# Altium schematic sheet 3dB_Attenuator.SchDoc
size A4; SheetNumber: 20; SheetTotal: 26
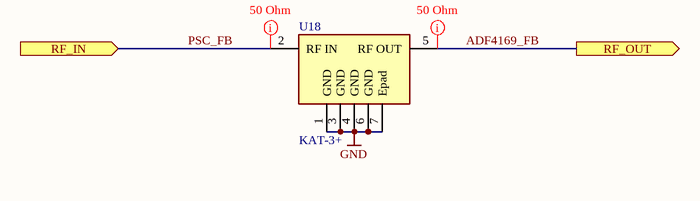
[diagram p0: 3dB_Attenuator.SchDoc]

## Parts
U18  KAT-3+  [MC1630-1]

## Ports
RF_IN (in, see Top_Level[2C]), RF_OUT (out, see Top_Level[2C])

## Nets
GND: U18.1(GND) U18.3(GND) U18.4(GND) U18.6(GND) U18.7(Epad)
ADF4169_FB: U18.5(RF_OUT) ; port RF_OUT
PSC_FB: U18.2(RF_IN) ; port RF_IN

## Layout directives
net class 50R: ADF4169_FB, PSC_FB

## Library data of the parts
U18 = RF000015: Manufacturer: Minicircuits; ID: RF000015; Type: Attenuator; Manufacturer Part Number: KAT-3+; Part Value: KAT-3+; Case: MC1630-1; ComponentLink1Description: Datasheet; ComponentLink1URL: https://www.minicircuits.com/pdfs/KAT-3+.pdf; Supplier 1: Mouser; Supplier Part Number 1: 139-KAT-3+; Supplier 2: Digikey; Supplier Part Number 2: 3157-KAT-3+CT-ND